# Altium project jlink-Isolator.PrjPcb
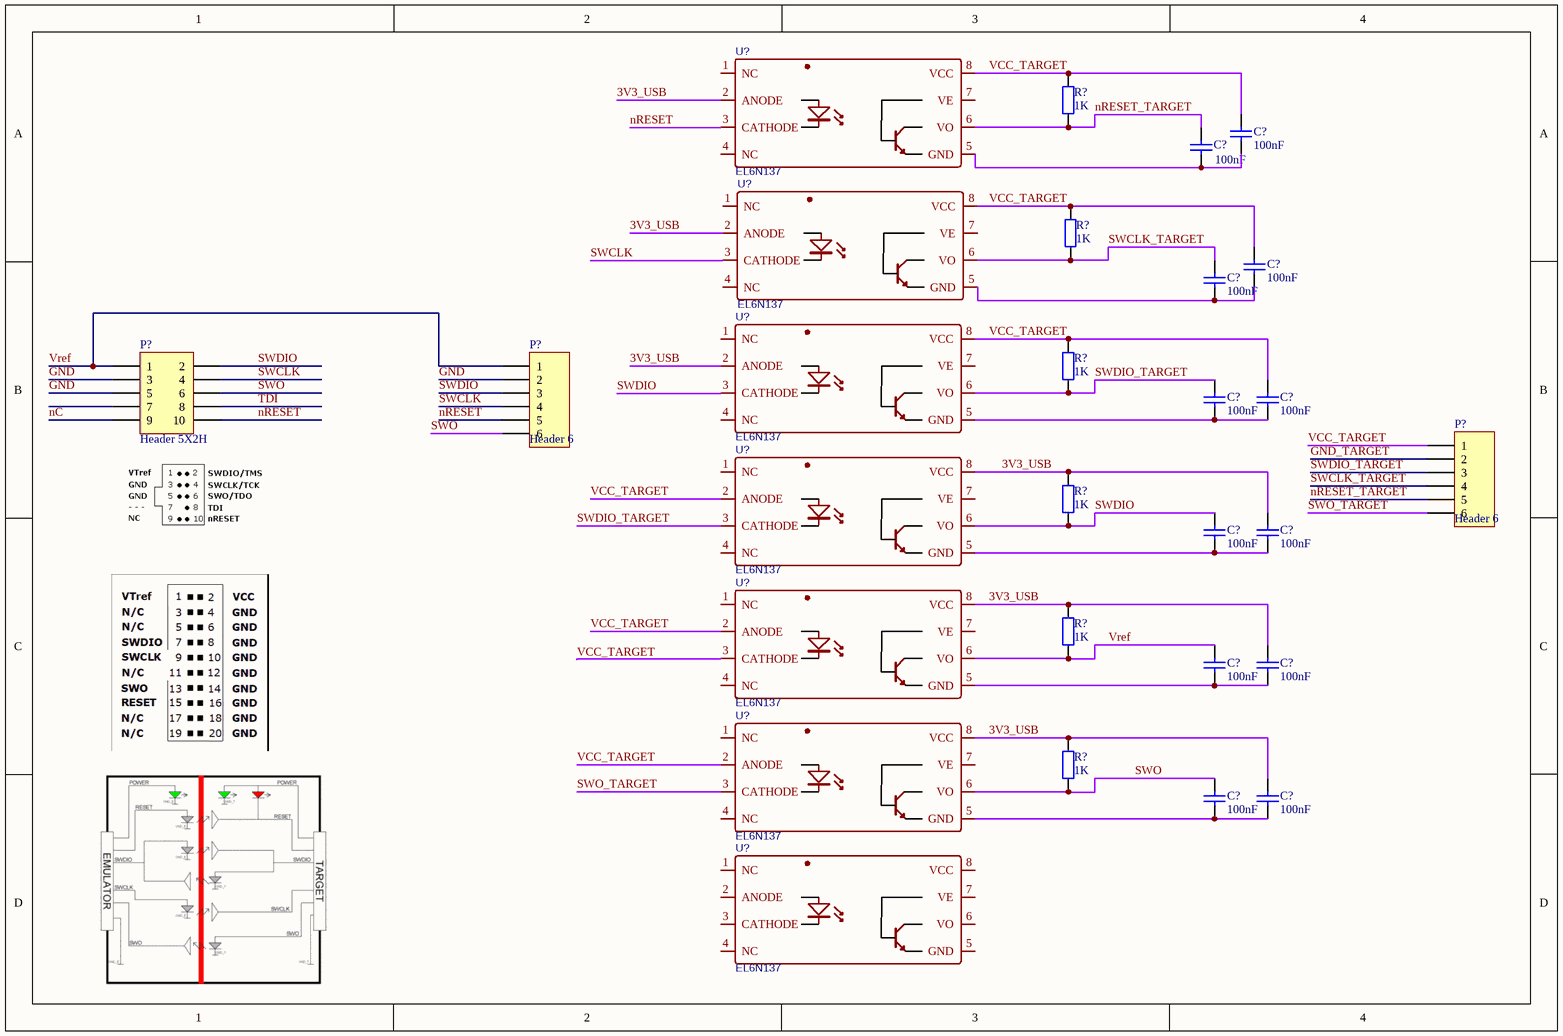
[diagram p0: SCH1.SchDoc]
2 sheets, 36 parts. Net scope: global (net labels, ports and power ports of the same name join across sheets).
Board file: jlinker-isolator.PcbDoc
Sheets:
  SCH1.SchDoc
  SCH2-USB-isolator.SchDoc

## Sheet SCH1.SchDoc
size A4

### Parts
(Parts that share a designator on the sheet are numbered #1, #2 ... from top to bottom, then left to right.)
C?#1  100nF  [0603_C]
C?#2  100nF  [0603_C]
C?#3  100nF  [0603_C]
C?#4  100nF  [0603_C]
C?#5  100nF  [0603_C]
C?#6  100nF  [0603_C]
C?#7  100nF  [0603_C]
C?#8  100nF  [0603_C]
C?#9  100nF  [0603_C]
C?#10  100nF  [0603_C]
C?#11  100nF  [0603_C]
C?#12  100nF  [0603_C]
P?#1  Header 5X2H  [MHDR2X5]
P?#2  Header 6  [HDR1X6]
P?#3  Header 6  [HDR1X6]
R?#1  1K  [0603_R]
R?#2  1K  [0603_R]
R?#3  1K  [0603_R]
R?#4  1K  [0603_R]
R?#5  1K  [0603_R]
R?#6  1K  [0603_R]
U?#1  EL6N137  [SOP-8_L9.8-W6.6-P2.54-LS10.3-BL]
U?#2  EL6N137  [SOP-8_L9.8-W6.6-P2.54-LS10.3-BL]
U?#3  EL6N137  [SOP-8_L9.8-W6.6-P2.54-LS10.3-BL]
U?#4  EL6N137  [SOP-8_L9.8-W6.6-P2.54-LS10.3-BL]
U?#5  EL6N137  [SOP-8_L9.8-W6.6-P2.54-LS10.3-BL]
U?#6  EL6N137  [SOP-8_L9.8-W6.6-P2.54-LS10.3-BL]
U?#7  EL6N137  [SOP-8_L9.8-W6.6-P2.54-LS10.3-BL]

### Nets
3V3_USB: C?#8.2 C?#10.2 C?#12.2 R?#4.2 R?#5.2 R?#6.2 U?#1.2(ANODE) U?#2.2(ANODE) U?#3.2(ANODE) U?#4.8(VCC) U?#5.8(VCC) U?#6.8(VCC)
GND: P?#1.3 P?#1.5 P?#2.2
GND_TARGET: P?#3.2
nC: P?#1.9
nRESET: P?#1.10 P?#2.5 U?#1.3(CATHODE)
nRESET_TARGET: C?#2.2 P?#3.5 R?#1.1 U?#1.6(VO)
SWCLK: P?#1.4 P?#2.4 U?#2.3(CATHODE)
SWCLK_TARGET: C?#4.2 P?#3.4 R?#2.1 U?#2.6(VO)
SWDIO: P?#1.2 P?#2.3 R?#4.1 U?#3.3(CATHODE) U?#4.6(VO)
SWDIO_TARGET: P?#3.3 R?#3.1 U?#3.6(VO) U?#4.3(CATHODE)
SWO: C?#11.2 P?#1.6 P?#2.6 R?#6.1 U?#6.6(VO)
SWO_TARGET: P?#3.6 U?#6.3(CATHODE)
TDI: P?#1.8
VCC_TARGET: C?#1.2 C?#3.2 C?#6.2 P?#3.1 R?#1.2 R?#2.2 R?#3.2 U?#1.8(VCC) U?#2.8(VCC) U?#3.8(VCC) U?#4.2(ANODE) U?#5.2(ANODE) U?#5.3(CATHODE) U?#6.2(ANODE)
Vref: C?#9.2 P?#1.1 P?#2.1 R?#5.1 U?#5.6(VO)
NetC?#1_1: C?#1.1 C?#2.1 U?#1.5(GND)
NetC?#3_1: C?#3.1 C?#4.1 U?#2.5(GND)
NetC?#5_1: C?#5.1 C?#6.1 U?#3.5(GND)
NetC?#7_1: C?#7.1 C?#8.1 U?#4.5(GND)
NetC?#9_1: C?#9.1 C?#10.1 U?#5.5(GND)
NetC?#11_1: C?#11.1 C?#12.1 U?#6.5(GND)

Not connected (* = marked no-connect by the designer): C?#5 2; C?#7 2; P?#1 7; U?#1 1(NC) 4(NC) 7(VE); U?#2 1(NC) 4(NC) 7(VE); U?#3 1(NC) 4(NC) 7(VE); U?#4 1(NC) 4(NC) 7(VE); U?#5 1(NC) 4(NC) 7(VE); U?#6 1(NC) 4(NC) 7(VE); U?#7 1(NC) 2(ANODE) 3(CATHODE) 4(NC) 5(GND) 6(VO) 7(VE) 8(VCC)

### Notes on the sheet
- Title
- Size:
- Date:
- File:
- E
- Number:
- Time:
- Revision:
- Sheet
- of

### Library data of the parts
C?#1-C?#12 = 0603 100nF (104) 10% 50V: 0603贴片电容; ComponentLink1Description: 供应商链接; ComponentLink1URL: http://www.szlcsc.com/product/details_15331.html; Package: 0603; Supplier: LC; SuppliersPartNumber: C14663
P?#1 = Header 5X2H: Header, 5-Pin, Dual row, Right Angle; LatestRevisionDate: 17-Jul-2002; LatestRevisionNote: Re-released for DXP Platform.; Publisher: Altium Limited
P?#2 P?#3 = Header 6: Header, 6-Pin; LatestRevisionDate: 17-Jul-2002; LatestRevisionNote: Re-released for DXP Platform.; Publisher: Altium Limited
R?#1-R?#6 = Res2: 0603贴片电阻; Published: 8-Jun-2000; LatestRevisionDate: 17-Jul-2002; LatestRevisionNote: Re-released for DXP Platform.; PackageReference: AXIAL-0.4; Publisher: Altium Limited; PackageDescription: Axial Device, Thru-Hole; 2 Leads; 0.4 in Pin Spacing
U?#1-U?#7 = EL6N137: BOM_Manufacturer: CT Micro International; BOM_Manufacturer Part: 6N137(S)(T1); Contributor: LCSC; BOM_Supplier: LCSC; BOM_Supplier Part: C191867; BOM_JLCPCB Part Class: Extended Part; spicePre: U; spiceSymbolName: 6N137(S)(T1)

## Sheet SCH2-USB-isolator.SchDoc
size A4
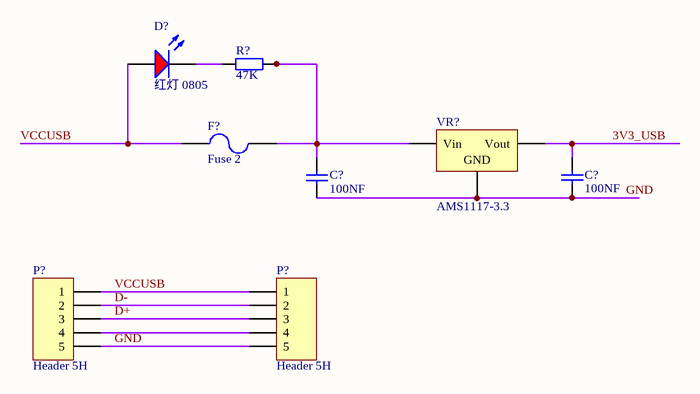
[diagram p1: SCH2-USB-isolator.SchDoc]

### Parts
(Parts that share a designator on the sheet are numbered #1, #2 ... from top to bottom, then left to right.)
C?#13  100NF  [0603_C]
C?#14  100NF  [0603_C]
D?  红灯 0805  [0805_LED_S1]
F?  Fuse 2  [FUSES]
P?#4  Header 5H  [HDR1X5H]
P?#5  Header 5H  [HDR1X5H]
R?#7  47K  [0805_R]
VR?  AMS1117-3.3  [SOT-223]

### Nets
3V3_USB: C?#14.2 VR?.2(Vout)
D+: P?#4.3 P?#5.3
D-: P?#4.2 P?#5.2
GND: C?#13.1 C?#14.1 P?#4.5 P?#5.5 VR?.1(GND)
VCCUSB: D?.A F?.1 P?#4.1 P?#5.1
NetC?#13_2: C?#13.2 F?.2 R?#7.2 VR?.3(Vin)
NetD?_K: D?.K R?#7.1
NetP?#4_4: P?#4.4 P?#5.4

### Notes on the sheet
- Title
- Size:
- Date:
- File:
- E
- Number:
- Time:
- Revision:
- Sheet
- of

### Library data of the parts
C?#13 C?#14 = Cap: 0603贴片电容; Published: 8-Jun-2000; LatestRevisionDate: 17-Jul-2002; LatestRevisionNote: Re-released for DXP Platform.; PackageReference: RAD-0.3; Publisher: Altium Limited; PackageDescription: Radial Cap, Thru-Hole; 2 Leads; 0.3 in Pin Spacing
D? = 0805 红灯: 发光二极管; ComponentLink1Description: 供应商链接; ComponentLink1URL: http://www.szlcsc.com/product/details_2668.html; Package: 0805; Supplier: LC; SuppliersPartNumber: C2295
F? = Fuse 2: Fuse; Published: 8-Jun-2000; LatestRevisionDate: 17-Jul-2002; LatestRevisionNote: Re-released for DXP Platform.; PackageReference: PIN-W2/E2.8; Publisher: Altium Limited; PackageDescription: Thru-Hole; 2 Leads
P?#4 P?#5 = Header 5H: Header, 5-Pin, Right Angle; LatestRevisionDate: 17-Jul-2002; LatestRevisionNote: Re-released for DXP Platform.; Publisher: Altium Limited
R?#7 = Res2: 0805贴片电阻; Published: 8-Jun-2000; LatestRevisionDate: 17-Jul-2002; LatestRevisionNote: Re-released for DXP Platform.; PackageReference: AXIAL-0.4; Publisher: Altium Limited; PackageDescription: Axial Device, Thru-Hole; 2 Leads; 0.4 in Pin Spacing
VR? = SOT-223 AMS1117-3.3: 低压差线性稳压(LDO); ComponentLink1Description: 供应商链接; ComponentLink1URL: http://www.szlcsc.com/product/details_6652.html; Package: SOT-223; Supplier: LC; SuppliersPartNumber: C6186

## Nets that join several sheets
3V3_USB: SCH1 (12 pins), SCH2-USB-isolator (C?#14.2 VR?.2)
GND: SCH1 (P?#1.3 P?#1.5 P?#2.2), SCH2-USB-isolator (5 pins)